# EAGLE design COMPARE (EAGLE 7.2.0)
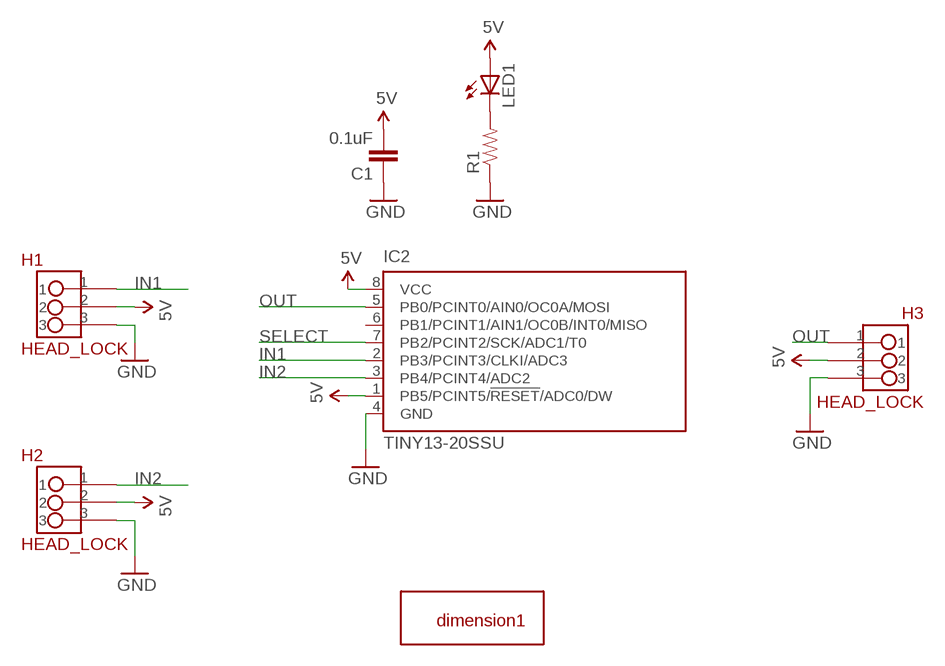
[diagram p0: schematic, sheet 1]

## Parts
C1  0.1uF  0.1UF-25V(+80/-20%)(0603)  [0603-CAP]
H1  HEAD_LOCK  [HEAD_LOCK]
H2  HEAD_LOCK  [HEAD_LOCK]
H3  HEAD_LOCK  [HEAD_LOCK]
IC2  TINY13-20SSU  [8S1]
LED1  LEDSML0603  [SML0603]
R1  RESISTOR0603-RES  [0603-RES]
U$1  DIMENSION1  [DIMENSION1]

## Nets
5V: C1.2 H1.2 H2.2 H3.2 IC2.1(PB5/PCINT5/!RESET!/ADC0/DW) IC2.8(VCC) LED1.A
GND: C1.1 H1.3 H2.3 H3.3 IC2.4(GND) R1.1
IN1: H1.1 IC2.2(PB3/PCINT3/CLKI/ADC3)
IN2: H2.1 IC2.3(PB4/PCINT4/ADC2)
N$1: LED1.C R1.2
OUT: H3.1 IC2.5(PB0/PCINT0/AIN0/OC0A/MOSI)
SELECT: IC2.7(PB2/PCINT2/SCK/ADC1/T0)
Unconnected: IC2.6(PB1/PCINT1/AIN1/OC0B/INT0/MISO)

## Library data of the parts
C1 = SparkFun-Capacitors:0.1UF-25V(+80/-20%)(0603): CAP-00810 Ceramic Standard decoupling cap; PROD_ID: CAP-00810
H1-H3 = HEAD_LOCK:HEAD_LOCK: 带锁的排座
IC2 = atmel:TINY13: 8-bit AVR Microcontroller with 1K Bytes In-System Programmable Flash Source: http://www.atmel.com/dyn/resources/prod_documents/2535S.pdf; MPN: ATTINY13-20SSU; OC_FARNELL: 1455133; OC_NEWARK: 58M3771
LED1 = led:LED: LED OSRAM: - CHIPLED LG R971, LG N971, LY N971, LG Q971, LY Q971, LO R971, LY R971 LH N974, LH R974 LS Q976, LO Q976, LY Q976 LO Q996 - Hyper CHIPLED LW Q18S LB Q993, LB Q99A, LB R99A - SideLED LS A670, LO A670, LY A670, LG A670, LP A670 LB A673, LV A673, LT A673, LW A673 LH A674 LY A675 LS A676, LA A676, LO A676, LY A676, LW A676 LS A679, LY A679, LG A679 - Hyper Micro SIDELED® LS Y876, LA Y876, LO Y876, LY Y876 LT Y87S - SmartLED LW L88C, LW L88S LB L89C, LB L89S, LG L890 LS L89K, LO L89K, LY L89K LS L896, LA L896, LO L896, LY L896 - TOPLED LS T670, LO T670, LY T670, LG T670, LP T670 LSG T670, LSP T670, LSY T670, LOP T670, LYG T670 LG T671, LOG T671, LSG T671 LB T673, LV T673, LT T673, LW T673 LH T674 LS T676, LA T676, LO T676, LY T676, LB T676, LH T676, LSB T676, LW T676 LB T67C, LV T67C, LT T67C, LS T67K, LO T67K, LY T67K, LW E67C LS E67B, LA E67B, LO E67B, LY E67B, LB E67C, LV E67C, LT E67C LW T67C LS T679, LY T679, LG T679 LS T770, LO T770, LY T770, LG T770, LP T770 LB T773, LV T773, LT T773, LW T773 LH T774 LS E675, LA E675, LY E675, LS T675 LS T776, LA T776, LO T776, LY T776, LB T776 LHGB T686 LT T68C, LB T68C - Hyper Mini TOPLED® LB M676 - Mini TOPLED Santana® LG M470 LS M47K, LO M47K, LY M47K Source: http://www.osram.convergy.de LUXEON: - LUMILED® LXK2-PW12-R00, LXK2-PW12-S00, LXK2-PW14-U00, LXK2-PW14-V00 LXK2-PM12-R00, LXK2-PM12-S00, LXK2-PM14-U00 LXK2-PE12-Q00, LXK2-PE12-R00, LXK2-PE12-S00, LXK2-PE14-T00, LXK2-PE14-U00 LXK2-PB12-K00, LXK2-PB12-L00, LXK2-PB12-M00, LXK2-PB14-N00, LXK2-PB14-P00, LXK2-PB14-Q00 LXK2-PR12-L00, LXK2-PR12-M00, LXK2-PR14-Q00, LXK2-PR14-R00 LXK2-PD12-Q00, LXK2-PD12-R00, LXK2-PD12-S00 LXK2-PH12-R00, LXK2-PH12-S00 LXK2-PL12-P00, LXK2-PL12-Q00, LXK2-PL12-R00 Source: www.luxeon.com KINGBRIGHT: KA-3528ASYC Source: www.kingbright.com
R1 = SparkFun-Passives:RESISTOR: Resistor Basic schematic elements and footprints for 0603, 1206, and PTH resistors.
U$1 = Xmaker_yuhui:DIMENSION1

## Board
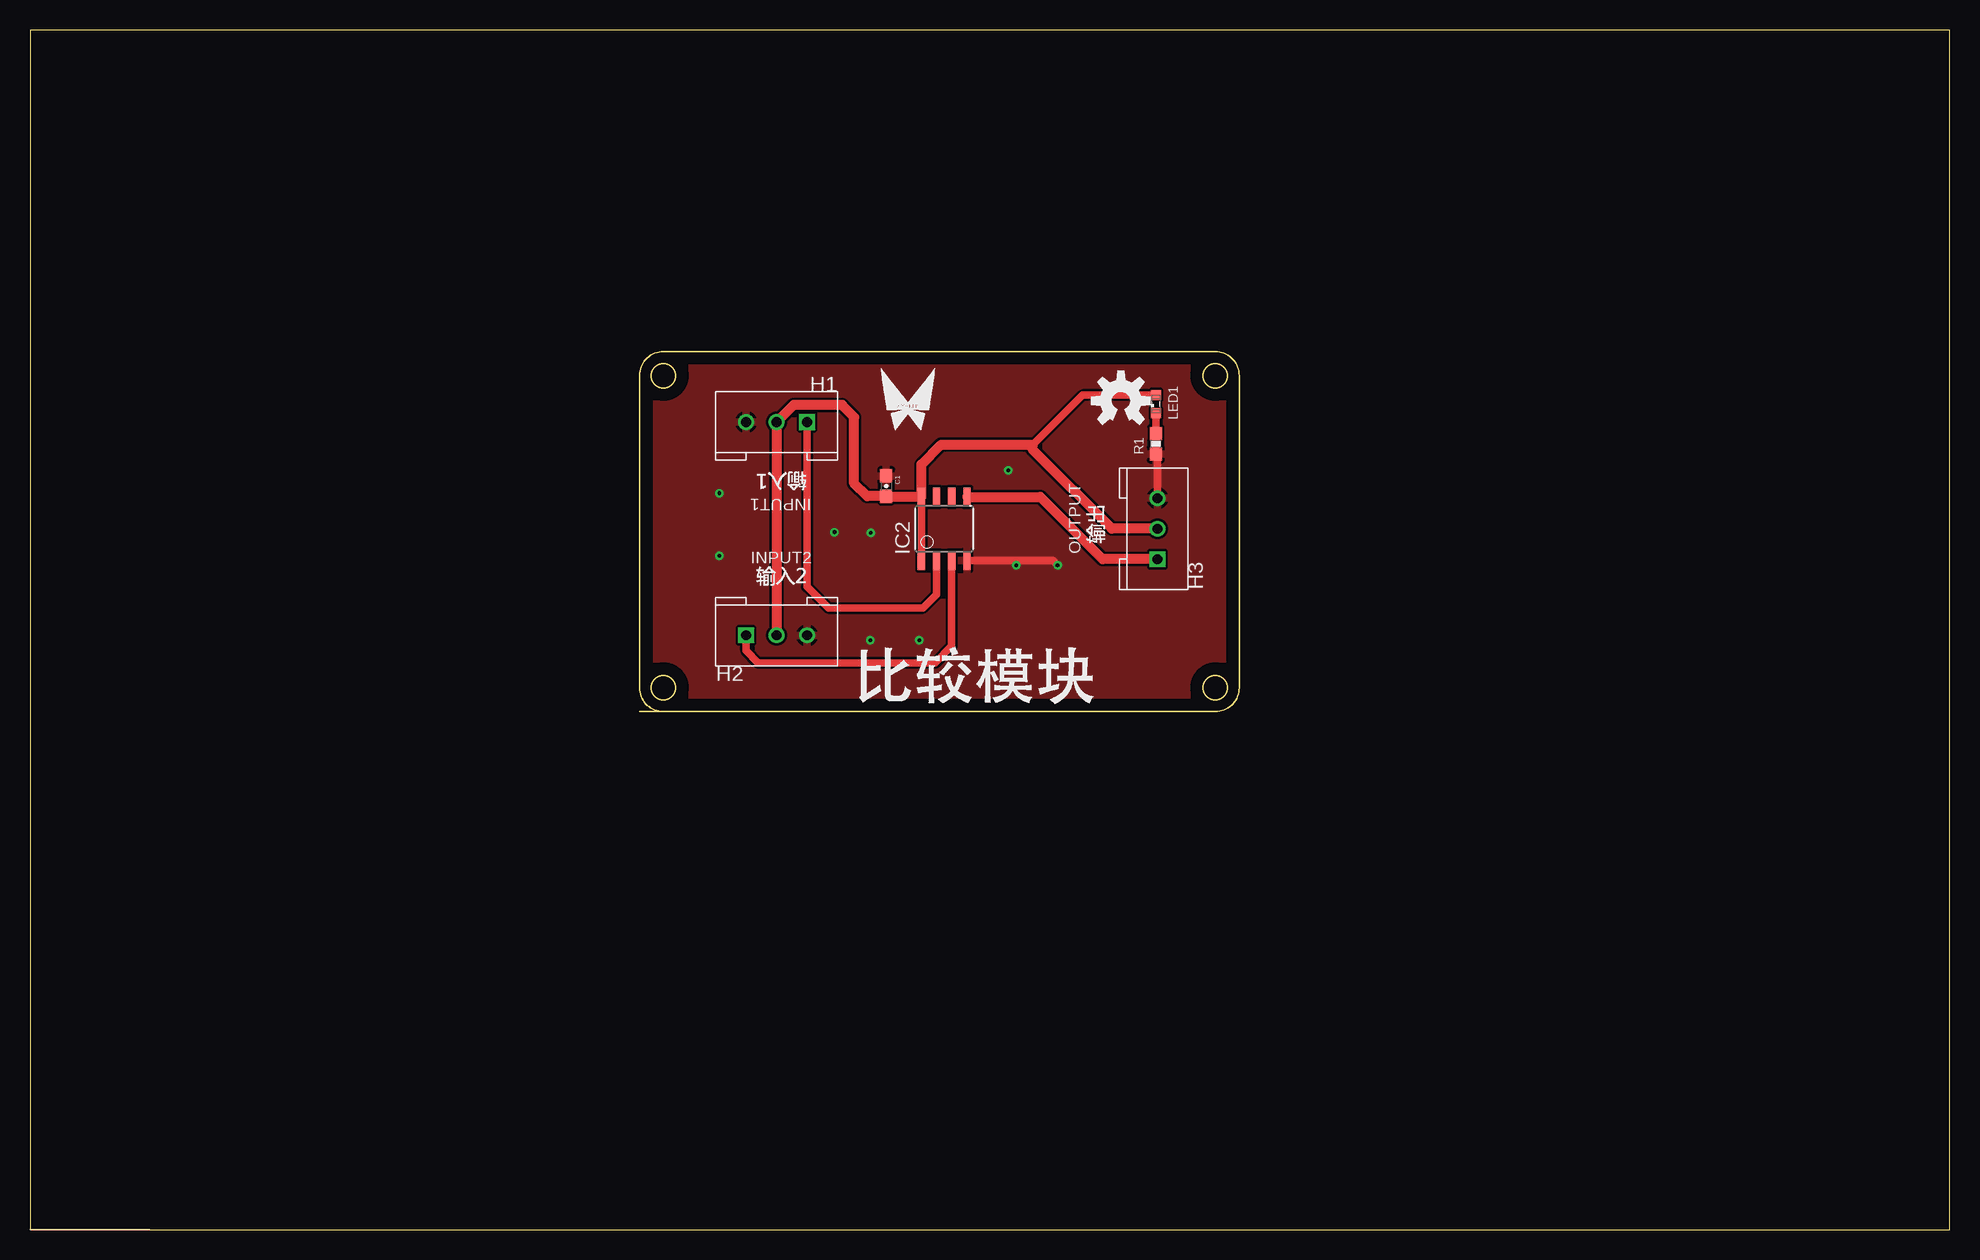
[diagram p1: board, top side]
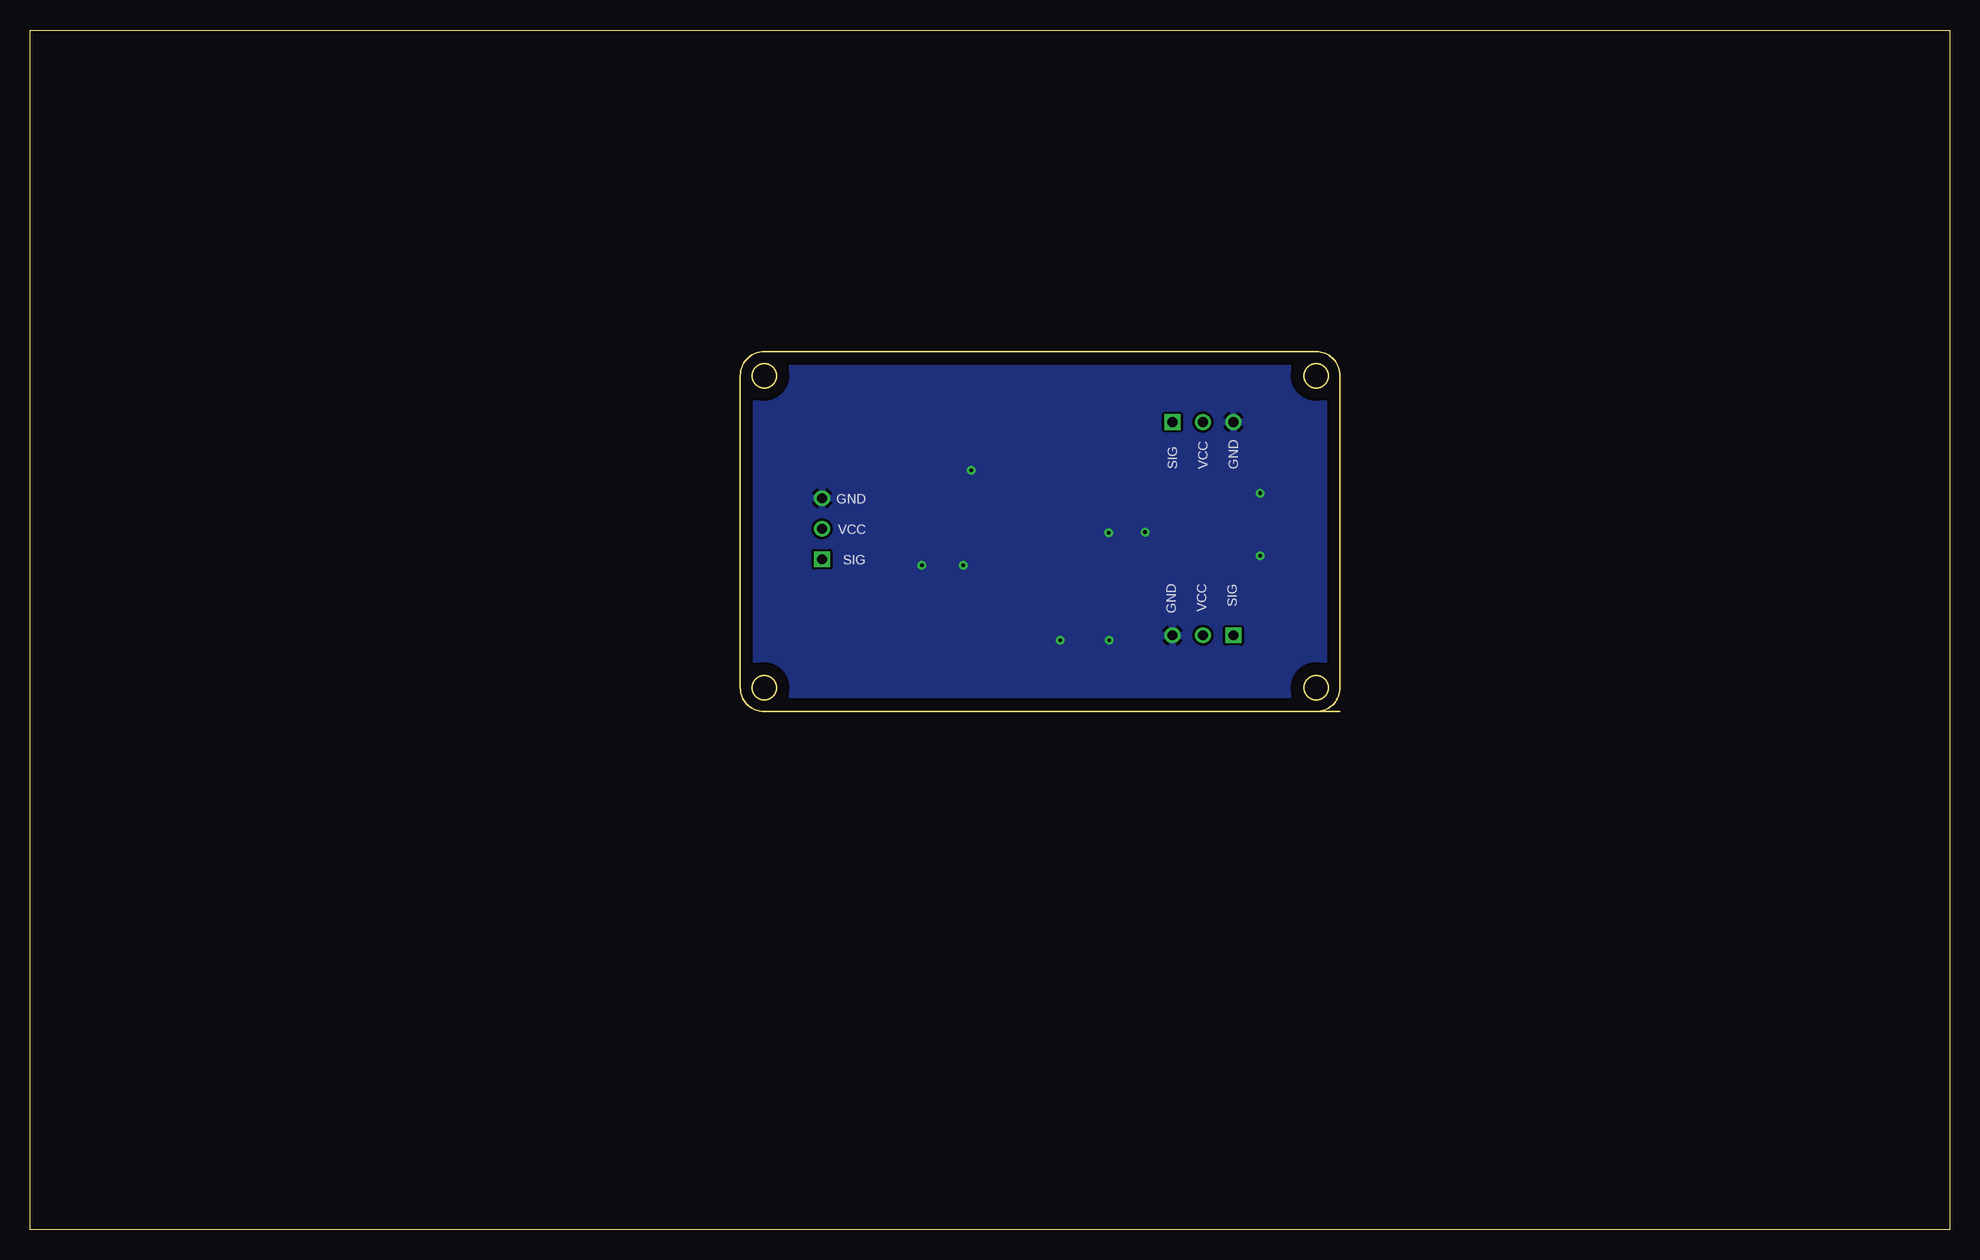
[diagram p2: board, bottom side, seen from below]

Size 160 x 100 mm. Coordinates in mm from the lower left corner, seen from the top.
Outline: 0,0 160,0 160,100 0,100 0,0
Copper layers (1*16): Top 0.035mm / dielectric 1.5mm / Bottom 0.035mm
Design rules "default": minimum track width 10mil, minimum drill 24mil, track to track 8mil, track to pad 8mil, pad to pad 8mil, via to via 8mil, smd to smd 8mil, copper to edge 40mil, drill to drill 8mil, minimum pad ring 10mil, minimum via ring 8mil, stop-mask expansion 4mil, vias tented up to drill 0mil, thermal gap 10mil

### Footprints (pad centres in the part's own frame; a part is rotated, then mirrored left to right if it is on the bottom)
0603-CAP = smd 1.1 x 1: 1 -0.85,0; 2 0.85,0
HEAD_LOCK = drill 0.8 square: 1 0,0 | drill 0.8: 2 2.54,0; 3 5.08,0
8S1 = smd 0.6 x 1.6: 1 -1.905,-2.654; 2 -0.645,-2.654; 3 0.625,-2.654; 4 1.895,-2.654; 5 1.905,2.654; 6 0.635,2.654; 7 -0.635,2.654; 8 -1.905,2.654
SML0603 = smd 0.8 x 0.8: A 0.75,0; C -0.75,0
0603-RES = smd 1.1 x 1: 1 -0.85,0; 2 0.85,0

### Placement (x,y rotation side)
C1  71.37,61.98 270 top
H1  64.77,67.31 180 top
H2  59.69,49.53 0 top
H3  93.98,55.88 90 top
IC2  76.2,58.42 0 top
LED1  93.85,68.81 90 top
R1  93.85,65.51 90 top
U$1  50.8,43.18 0 top
U$2  [OSHW-LOGO-M]  90.93,69.09 0 top

### Tracks (layer width: path | path; a pad name or v marks a point on that pad's centre or on a via)
5V
  Top 0.61: IC2.8 IC2.1 | LED1.A 87.75,69.56 83.57,65.38
  Top 0.813: H2.2 H1.2 63.65,68.73 67.69,68.73 68.71,67.72 68.71,62.2 69.79,61.13 C1.2 71.43,61.07 IC2.8 74.3,63.78 75.95,65.43 83.52,65.43 83.57,65.38 83.57,65.02 90.17,58.42 H3.2
GND  (via drill 0.3)
  Top 0.61: R1.1 93.98,64.66 H3.3 | IC2.4 85.25,55.77 v85.65,55.37
  other vias: 57.45,61.39 57.45,56.16 67.06,58.14 70.08,58.09 81.53,63.3 82.19,55.37 74.12,49.12 70.05,49.12
  pour Bottom: 46.74,75.18 103.89,75.18 103.89,38.86 46.48,38.86 46.48,75.18
  pour Top: 46.48,75.18 103.89,75.18 103.89,38.86 46.48,38.86
IN1
  Top 0.61: H1.1 64.77,53.59 66.55,51.82 74.42,51.82 75.56,52.95 IC2.2
IN2
  Top 0.61: IC2.3 76.83,48.63 75.44,47.24 60.71,47.24 59.69,48.26 H2.1
N$1
  Top 0.61: LED1.C R1.2
OUT
  Top 0.813: H3.1 89.41,55.88 84.21,61.07 IC2.5

### Text on the board
tPlace: INPUT1 | INPUT2 | OUTPUT | C:/Users/Xiangzi/Desktop/Ãû³Æ/XMAKER_PCB3.bmp | C:/Users/Xiangzi/Desktop/Ãû³Æ/XMAKER_PCB3.bmp | C:/Users/Xiangzi/Desktop/Ãû³Æ/XMAKER_PCB3.bmp | C:/Users/Xiangzi/Desktop/Ãû³Æ/±ȽÏÄ£¿é.bmp | C:/Users/Xiangzi/Desktop/Ãû³Æ/Êä³ö.bmp | C:/Users/Xiangzi/Desktop/Ãû³Æ/ÊäÈë1.bmp | C:/Users/Xiangzi/Desktop/Ãû³Æ/ÊäÈë2.bmp
bPlace: GND | VCC | SIG | GND | VCC | SIG | SIG | VCC | GND